# EAGLE schematic cell (EAGLE 7.1.0)
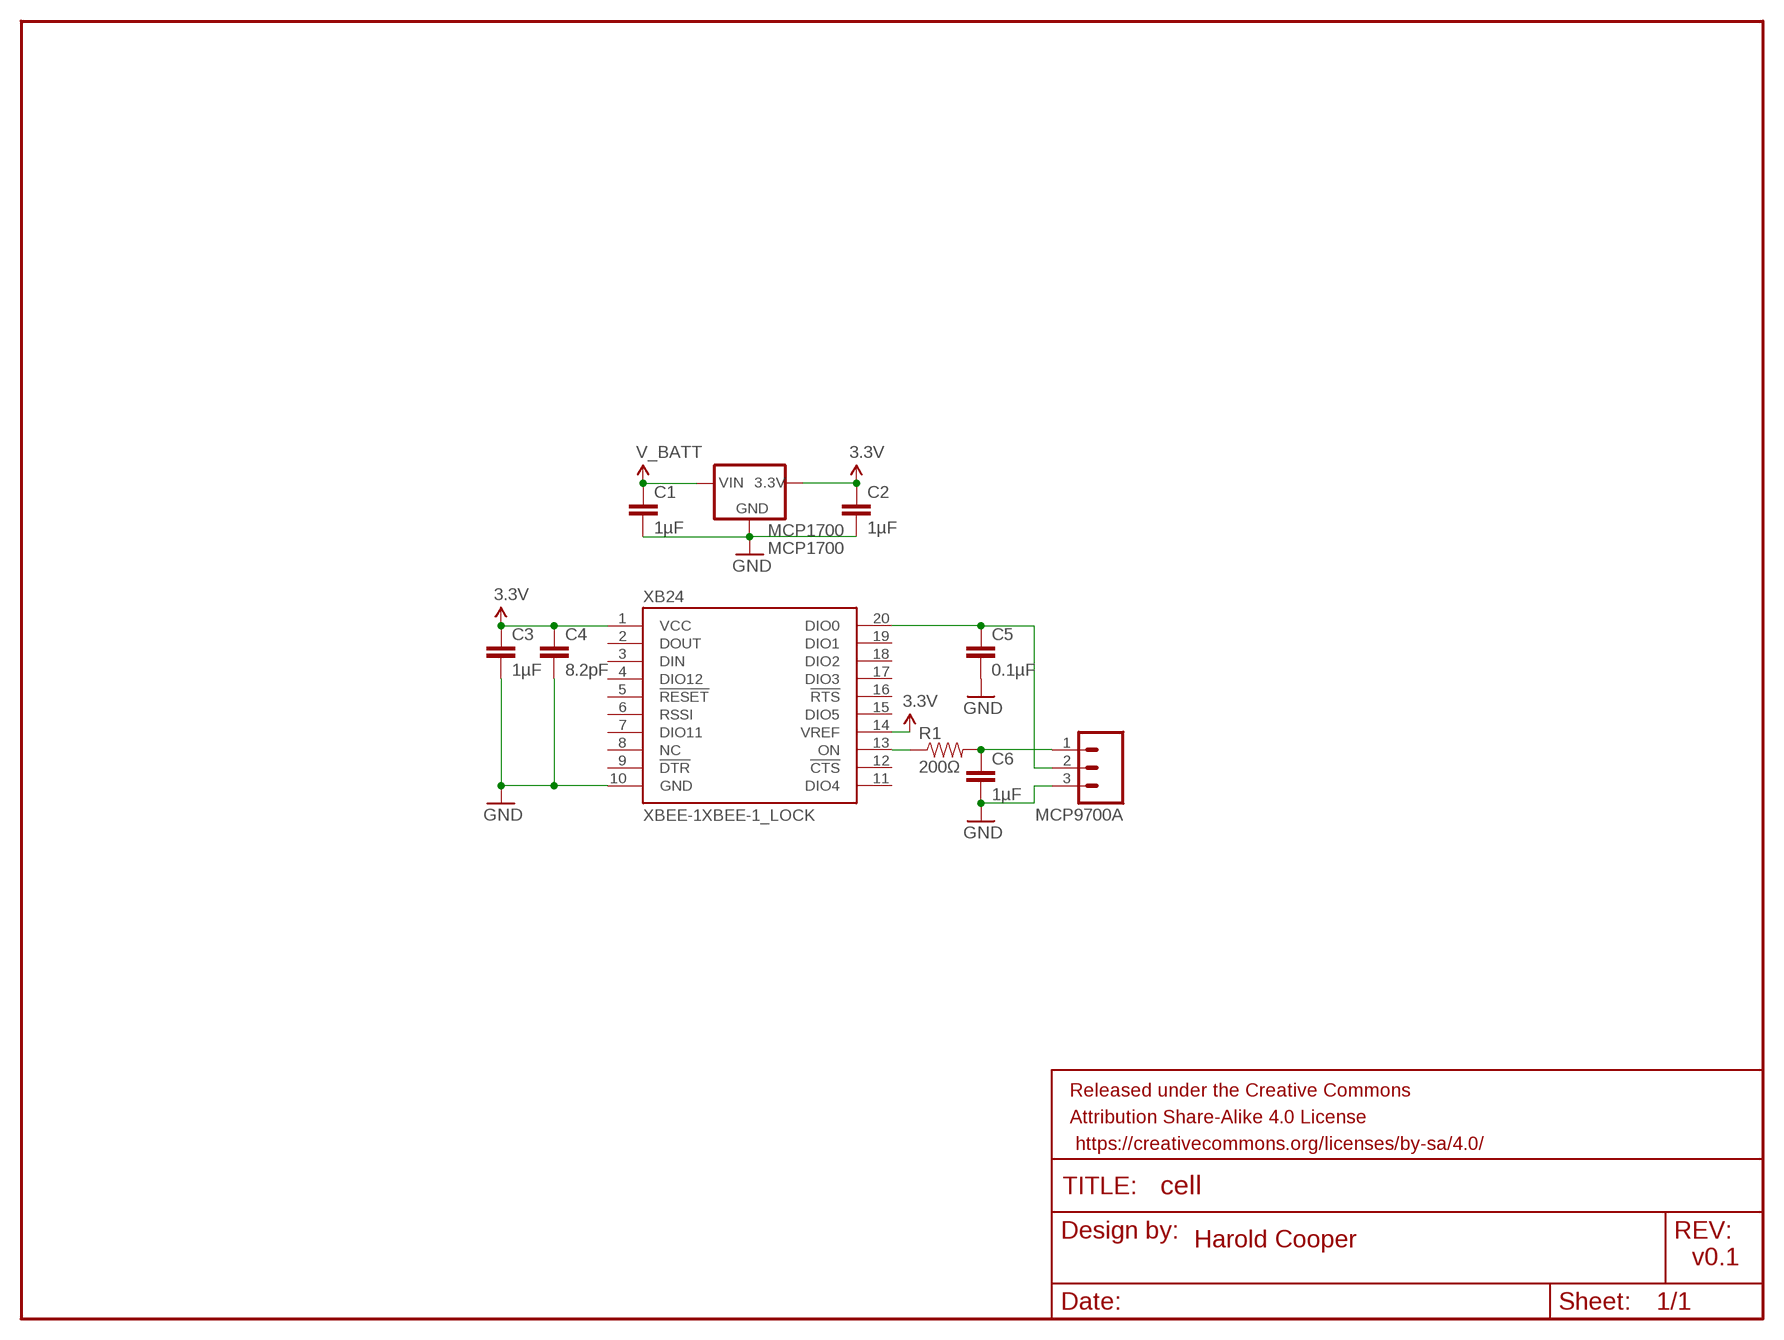
[diagram p0: schematic, sheet 1]

## Parts
C1  1µF  CAP0805  [0805]
C2  1µF  CAP0805  [0805]
C3  1µF  CAP0805  [0805]
C4  8.2pF  CAP0805  [0805]
C5  0.1µF  CAP0805  [0805]
C6  1µF  CAP0805  [0805]
FRAME1  FRAME-LETTER  [CREATIVE_COMMONS]
MCP1700  MCP1700  [SOT-89-3]
MCP9700A  M03LOCK  [1X03_LOCK]
R1  200Ω  RESISTOR0805-RES  [0805]
XB24  XBEE-1XBEE-1_LOCK  [XBEE-1_LOCK]

## Nets
3.3V: C2.1 C3.1 C4.1 MCP1700.3(3.3V) XB24.1(VCC) XB24.14(VREF)
GND: C1.2 C2.2 C3.2 C4.2 C5.2 C6.2 MCP1700.1(GND) MCP9700A.3 XB24.10(GND)
N$1: C6.1 MCP9700A.1 R1.2
N$2: R1.1 XB24.13(ON)
N$3: C5.1 MCP9700A.2 XB24.20(DIO0)
V_BATT: C1.1 MCP1700.2(IN)
Unconnected: XB24.2(DOUT) XB24.3(DIN) XB24.4(DIO12) XB24.5(!RESET) XB24.6(RSSI) XB24.7(DIO11) XB24.8(NC) XB24.9(!DTR) XB24.11(DIO4) XB24.12(!CTS) XB24.15(DIO5) XB24.16(!RTS) XB24.17(DIO3) XB24.18(DIO2) XB24.19(DIO1)

## Notes on the sheet
- Harold Cooper
- v0.1

## Library data of the parts
C1-C6 = SparkFun-Capacitors:CAP: Capacitor Standard 0603 ceramic capacitor, and 0.1" leaded capacitor.
FRAME1 = SparkFun-Aesthetics:FRAME-LETTER: Schematic Frame Standard 8.5x11 US Letter frame
MCP1700 = hrldcpr:MCP1700
MCP9700A = SparkFun-Connectors:M03: Header 3 Standard 3-pin 0.1" header. Use with straight break away headers (SKU : PRT-00116), right angle break away headers (PRT-00553), swiss pins (PRT-00743), machine pins (PRT-00117), and female headers (PRT-00115). Molex polarized connector foot print use with SKU : PRT-08232 with associated crimp pins and housings.
R1 = SparkFun-Resistors:RESISTOR: Resistor Basic schematic elements and footprints for 0603, 1206, and PTH resistors.
XB24 = hrldcpr:XBEE-1: Xbee module footprints SMT header is CONN-09042.